# Altium project R2T_AVRPRG_PRJ-V2.PrjPcb
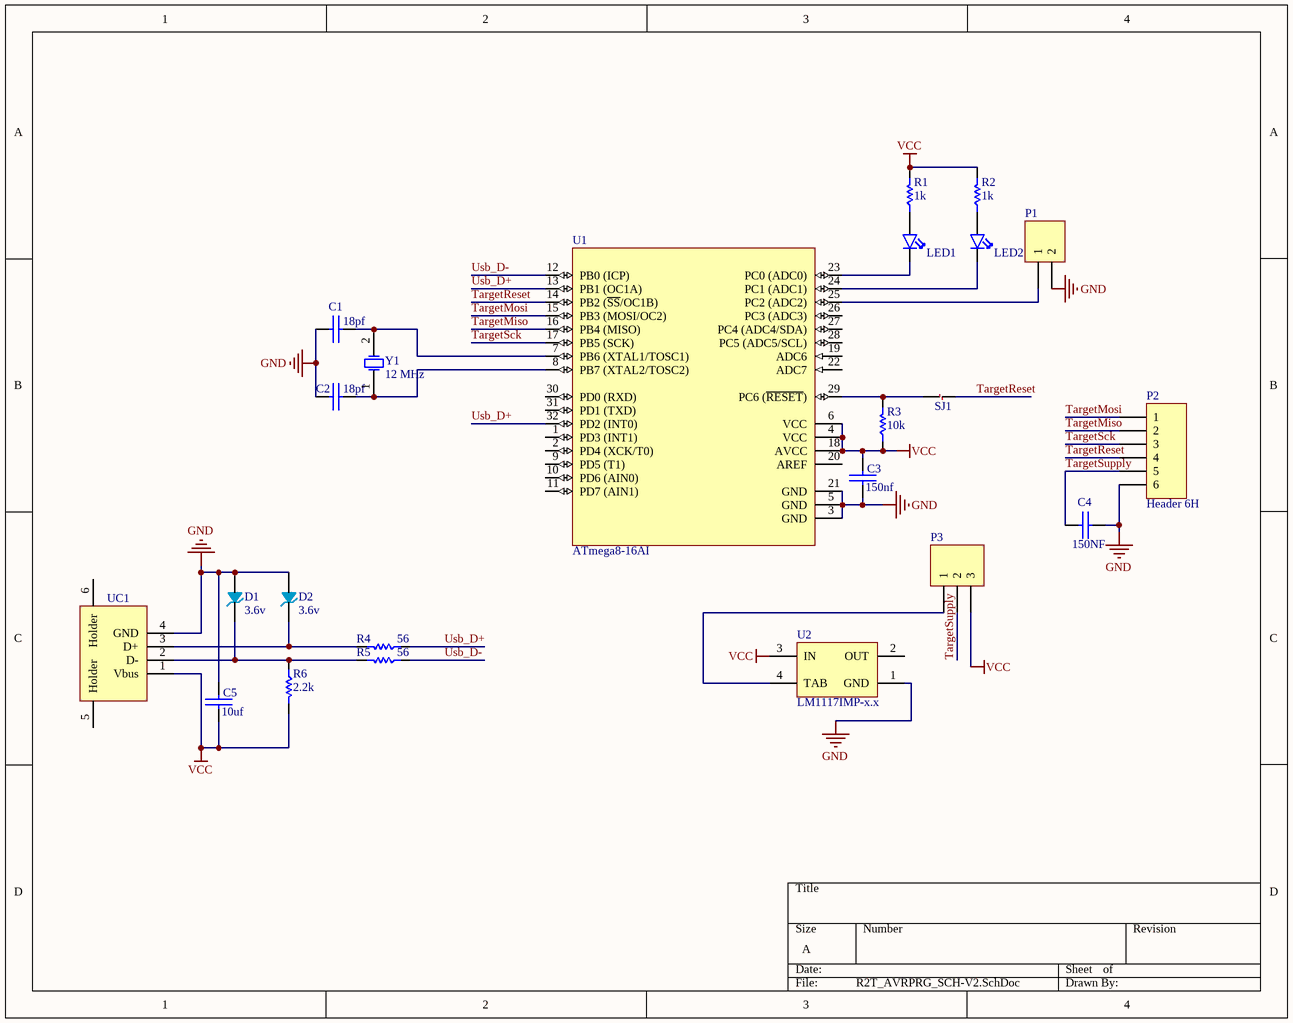
[diagram p0: R2T_AVRPRG_SCH-V2.SchDoc]
1 sheet, 23 parts. Net scope: global (net labels, ports and power ports of the same name join across sheets).
Board file: R2T_AVRPRG_PCB-V2.PcbDoc

## Sheet R2T_AVRPRG_SCH-V2.SchDoc
size A

### Parts
C1  18pf  [SMD_CAP_0805]
C2  18pf  [SMD_CAP_0805]
C3  150nf  [SMD_CAP_0805]
C4  150NF  [SMD_CAP_0805]
C5  10uf  [SMD_CAP_0805]
D1  3.6v  [DIOMELF3615N]
D2  3.6v  [DIOMELF3615N]
LED1  LED  [LED0805]  (value not drawn)
LED2  LED  [LED0805]  (value not drawn)
P1  Header 2  [HDR1X2]  (value not drawn)
P2  Header 6H  [HDR1X6H]
P3  Header 3  [HDR1X3]  (value not drawn)
R1  1k  [RES 0603 (1608X06L)]
R2  1k  [RES 0603 (1608X06L)]
R3  10k  [RES 0603 (1608X06L)]
R4  56  [RES 0603 (1608X06L)]
R5  56  [RES 0603 (1608X06L)]
R6  2.2k  [RES 0603 (1608X06L)]
SJ1  SmdJumper  [SMD Jumper]  (value not drawn)
U1  ATmega8-16AI  [32A_N]
U2  LM1117IMP-x.x  [MP04A_N]
UC1  Usb-A  [USB A Connector]  (value not drawn)
Y1  12 MHz  [Crystal SMD]

### Nets
GND: C1.1(+) C2.1(+) C3.1(+) C4.2(-) C5.2(-) D1.2 D2.2 P1.2 P2.6 U1.3(GND) U1.5(GND) U1.21(GND) U2.1(GND) UC1.4(GND)
VCC: C3.2(-) C5.1(+) P3.3 R1.2 R2.2 R3.1 R6.2 U1.4(VCC) U1.6(VCC) U1.18(AVCC) U2.3(IN) UC1.1(Vbus)
TargetMiso: P2.2 U1.16(PB4_(MISO))
TargetMosi: P2.1 U1.15(PB3_(MOSI/OC2))
TargetReset: P2.4 SJ1.2 U1.14(PB2_(~{SS}/OC1B))
TargetSck: P2.3 U1.17(PB5_(SCK))
TargetSupply: C4.1(+) P2.5 P3.2
Usb_D+: R4.1 U1.13(PB1_(OC1A)) U1.32(PD2_(INT0))
Usb_D-: R5.1 U1.12(PB0_(ICP))
NetC1_2: C1.2(-) U1.7(PB6_(XTAL1/TOSC1)) Y1.2(OSC2)
NetC2_2: C2.2(-) U1.8(PB7_(XTAL2/TOSC2)) Y1.1(OSC1)
NetD1_1: D1.1 R5.2 R6.1 UC1.2(D-)
NetD2_1: D2.1 R4.2 UC1.3(D+)
NetLED1_1: LED1.1(A) R1.1
NetLED1_2: LED1.2(K) U1.23(PC0_(ADC0))
NetLED2_1: LED2.1(A) R2.1
NetLED2_2: LED2.2(K) U1.24(PC1_(ADC1))
NetP1_1: P1.1 U1.25(PC2_(ADC2))
NetP3_1: P3.1 U2.4(TAB)
NetR3_2: R3.2 SJ1.1 U1.29(PC6_(~{RESET}))

Not connected (* = marked no-connect by the designer): U1 1(PD3_(INT1)) 2(PD4_(XCK/T0)) 9(PD5_(T1)) 10(PD6_(AIN0)) 11(PD7_(AIN1)) 19(ADC6) 20(AREF) 22(ADC7) 26(PC3_(ADC3)) 27(PC4_(ADC4/SDA)) 28(PC5_(ADC5/SCL)) 30(PD0_(RXD)) 31(PD1_(TXD)); U2 2(OUT); UC1 5(Holder) 6(Holder)

### Library data of the parts
C1-C5 = Cap-Bipolar: Bipolar Capacitor; Voltage: 100V; Designer: Saeid Jorablo; Organazation: ControTec; Adding Date: 1387/12/20
  C1 C2: Value: 18pf
  C3: Value: 150nf
  C4: Value: 150NF
  C5: Value: 10uf
D1 D2 = Diode Zener SMD: Designer: Hamed Jafarzadeh
LED1 LED2 = LED: Designer :: Razi Research Team Of Mashhad - Hamed Jafarzadeh
P1 = Header 2: Header, 2-Pin; LatestRevisionDate: 17-Jul-2002; LatestRevisionNote: Re-released for DXP Platform.; Publisher: Altium Limited
P2 = Header 6H: Header, 6-Pin, Right Angle; LatestRevisionDate: 17-Jul-2002; LatestRevisionNote: Re-released for DXP Platform.; Publisher: Altium Limited
P3 = Header 3: Header, 3-Pin; LatestRevisionDate: 17-Jul-2002; LatestRevisionNote: Re-released for DXP Platform.; Publisher: Altium Limited
R1-R6 = Resistor: Tolerance: 805
  R1 R2: Value: 1k
  R3: Value: 10k
  R4 R5: Value: 56
  R6: Value: 2.2k
U1 = ATmega8-16AI: 8-Bit AVR Microcontroller with 8K Bytes of In-System Programmable Flash Memory; Published: 17-Sep-2003; LatestRevisionDate: 13-Apr-2006; LatestRevisionNote: IPC-7351 Footprint Added.; DatasheetVersion: 2486H-AVR-09/02; PackageVersion: revB, Oct-2001; PackageReference: 32A; Publisher: Altium Limited; PackageDescription: 32-Pin Thin Quad Flat Pack 0.8 mm Pitch; Code_JEDEC: MS-026-ABA; ComponentLink1Description: Manufacturer Link; ComponentLink1URL: http://www.atmel.com; ComponentLink2Description: Datasheet; ComponentLink2URL: http://www.atmel.com/dyn/resources/prod_documents/doc2486.pdf
U2 = LM1117IMP-x.x: x.x Volt, 800mA Low-Dropout Linear Regulator, 4-pin SOT-223; PartNumber: LM1117IMP-3.3; Manufacturer: National Semiconductor; PackageTopMarking: XYTT*N05B; PowerWise: N; CompType: LDO IC; Published: 4-Dec-2008; DatasheetVersion: Apr-2006; PackageVersion: revB, Apr-2003; PackageReference: MP04A; Publisher: Altium Limited; PackageDescription: Molded SOT-223, 6.50 x 3.56 x 1.6mm Body, 4 Lead, 2.3mm Pitch; Supplier 1: Farnell; Supplier Part Number 1: 7614123; RoHS: N; PinCount: 4; Code_JEDEC: TO-261-AA; Code_IPC: SOT223-4; ComponentLink1Description: LM1117 Datasheet; ComponentLink1URL: http://www.national.com/ds/LM/LM1117.pdf; ComponentLink2Description: LM1117 Web Page; ComponentLink2URL: http://www.national.com/pf/LM/LM1117.html; ComponentLink3Description: MP04A Package Page; ComponentLink3URL: http://www.national.com/packaging/folders/mp04a.html
UC1 = USB: Designer :: HamedJafarzadeh
Y1 = XTAL: XTAL Crystal; Company: E.P.I.L; Design Date: 11/04/2011; Value: 12 MHz